# EAGLE design ASM2022 (EAGLE 6.3)
DATABASE: ./../../../../../Components/TinyCircuits_Part_Database.txt
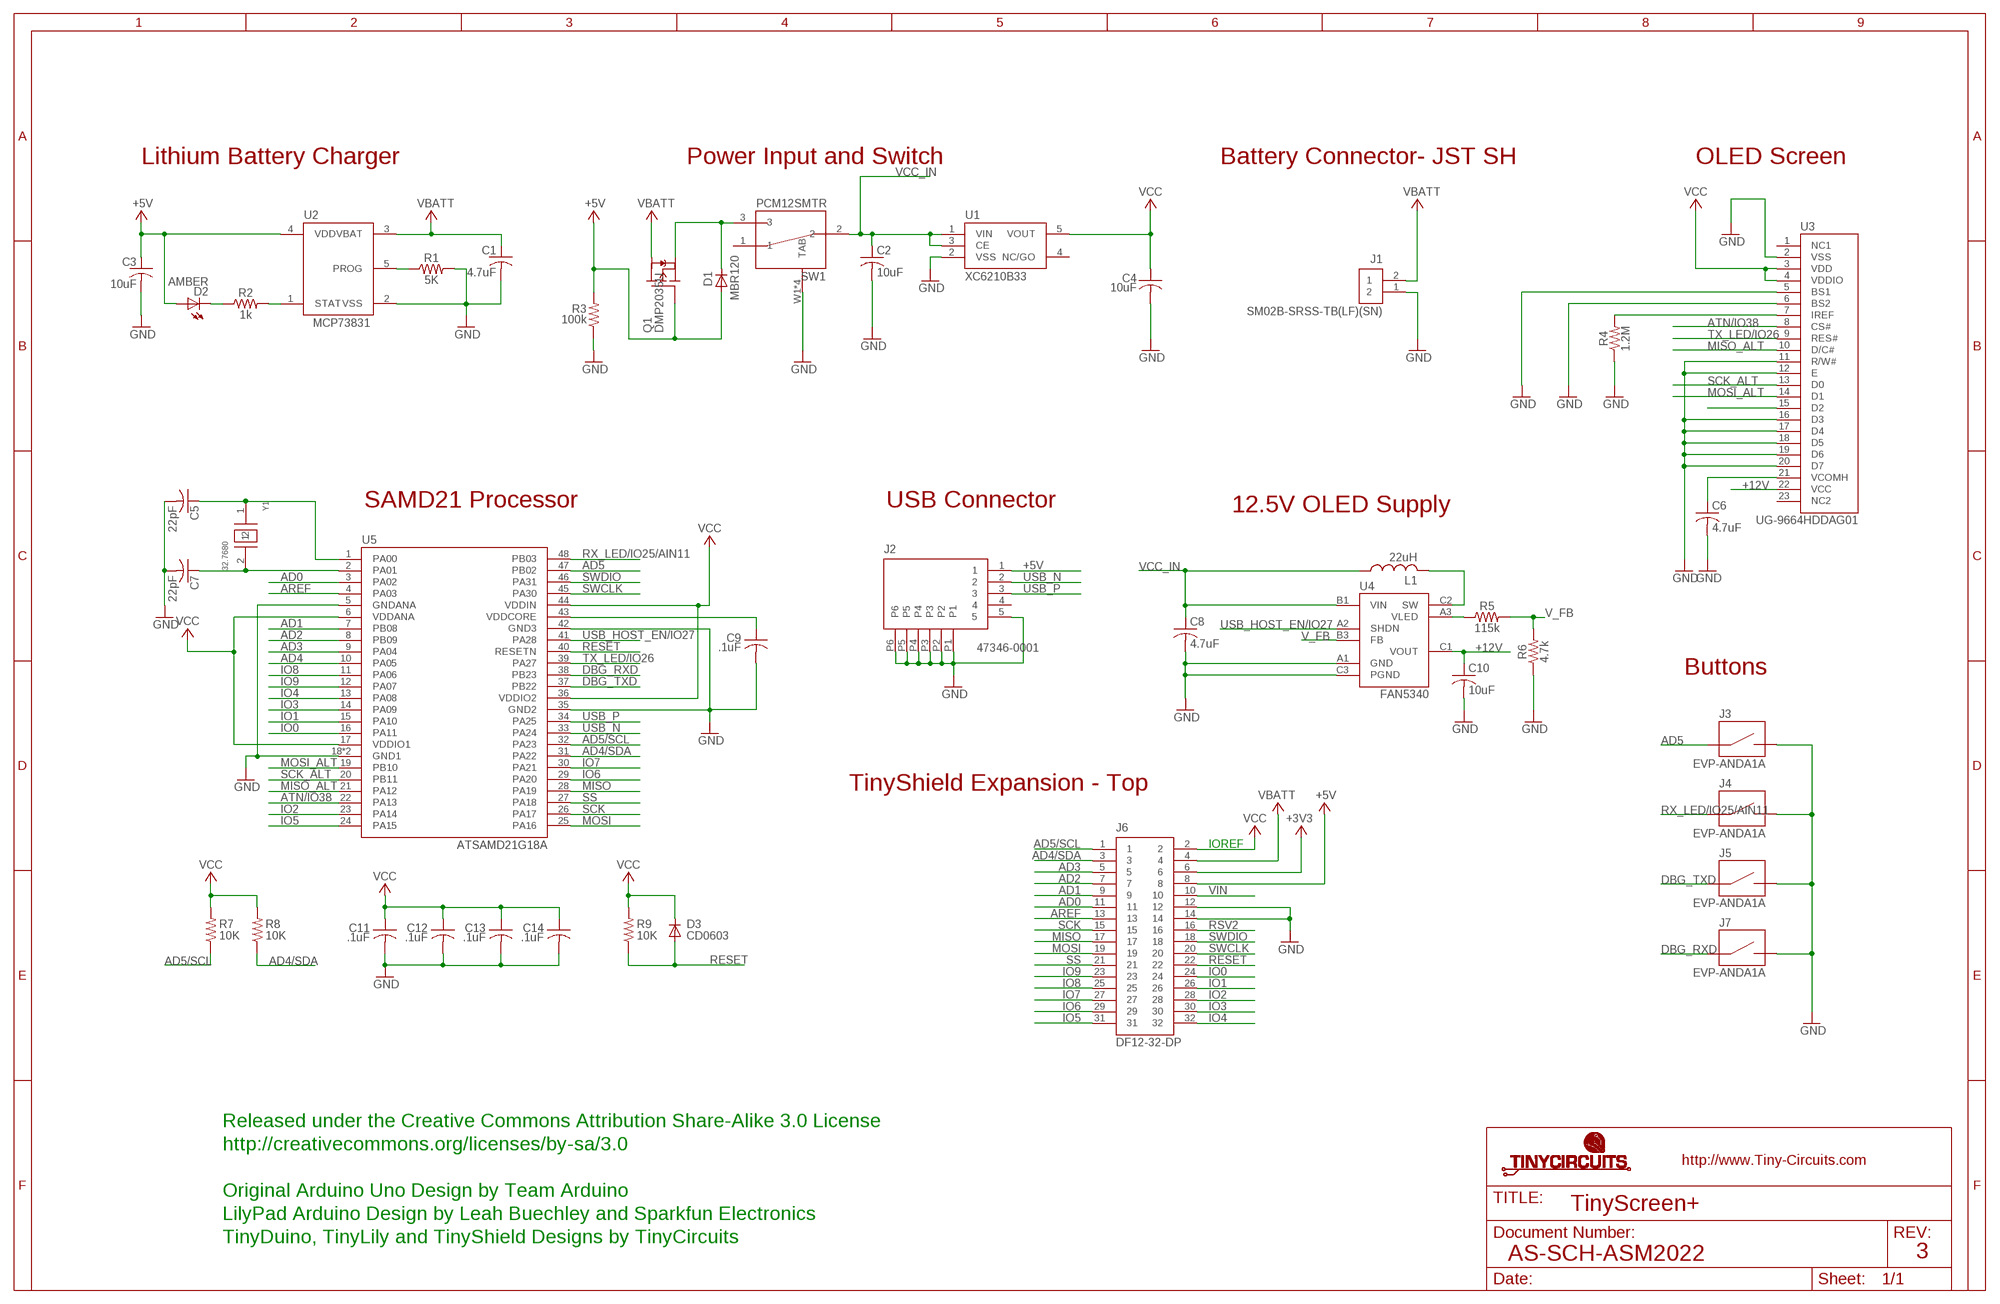
[diagram p0: schematic, sheet 1]

## Parts
C1  4.7uF  AS-ITM-00088  [C0603]
C2  10uF  AS-ITM-00045  [C0805]
C3  10uF  AS-ITM-00002  [C0603]
C4  10uF  AS-ITM-00002  [C0603]
C5  22pF  AS-ITM-00211  [C0402]
C6  4.7uF  AS-ITM-00232  [1206_CAP_TANT]
C7  22pF  AS-ITM-00211  [C0402]
C8  4.7uF  AS-ITM-00242  [C0402]
C9  .1uF  AS-ITM-00008  [C0402]
C10  10uF  AS-ITM-00045  [C0805]
C11  .1uF  AS-ITM-00008  [C0402]
C12  .1uF  AS-ITM-00008  [C0402]
C13  .1uF  AS-ITM-00008  [C0402]
C14  .1uF  AS-ITM-00008  [C0402]
D1  MBR120  AS-ITM-00111  [SOD-123FL]
D2  AMBER  AS-ITM-00026  [LNJ_LED]
D3  CD0603  AS-ITM-00009  [0603]
J1  SM02B-SRSS-TB(LF)(SN)  AS-ITM-00231  [JST_SH_2X1]
J2  47346-0001  AS-ITM-00021  [MICRO_USB]
J3  EVP-ANDA1A  AS-ITM-00236  [PTS840GKP]
J4  EVP-ANDA1A  AS-ITM-00236  [PTS840GKP]
J5  EVP-ANDA1A  AS-ITM-00236  [PTS840GKP]
J6  DF12-32-DP  AS-ITM-00015  [DF12-32-DP]
J7  EVP-ANDA1A  AS-ITM-00236  [PTS840GKP]
L1  22uH  AS-ITM-00281  [R0805]
Q1  DMP2035U  AS-ITM-00024  [SOT23]
R1  5K  AS-ITM-00289  [0402]
R2  1k  AS-ITM-00003  [0402]
R3  100k  AS-ITM-00004  [0402]
R4  1.2M  AS-ITM-00280  [0402]
R5  115k  AS-ITM-00179  [0402]
R6  4.7k  AS-ITM-00167  [0402]
R7  10K  AS-ITM-00032  [0402]
R8  10K  AS-ITM-00032  [0402]
R9  10K  AS-ITM-00032  [0402]
SW1  PCM12SMTR  AS-ITM-00220  [PCM12SMTR]
U1  XC6210B33  AS-ITM-00046  [SOT-25]
U2  MCP73831  AS-ITM-00136  [SOT-23]
U3  UG-9664HDDAG01  AS-ITM-00158  [OLED_DISPLAY]
U4  FAN5340  AS-ITM-00277  [WLCSP8_1_57X1_57]
U5  ATSAMD21G18A  AS-ITM-00273  [QFN48]
Y1  32.7680  AS-ITM-00279  [ABS06]

## Nets
+3V3: J6.6
+5V: C3.1 D1.A D2.A J2.1 J6.8 Q1.B(G) R3.2 U2.4(VDD)
+12V: C10.1 U3.22(VCC) U4.C1(VOUT)
AD0: J6.11 U5.3(PA02)
AD1: J6.9 U5.7(PB08)
AD2: J6.7 U5.8(PB09)
AD3: J6.5 U5.9(PA04)
AD4: U5.10(PA05)
AD4/SDA: J6.3 R8.1 U5.31(PA22)
AD5: J3.1 J3.2 U5.47(PB02)
AD5/SCL: J6.1 R7.1 U5.32(PA23)
AREF: J6.13 U5.4(PA03)
ATN/IO38: U3.8(CS#) U5.22(PA13)
DBG_RXD: J7.1 J7.2 U5.38(PB23)
DBG_TXD: J5.1 J5.2 U5.37(PB22)
GND: C1.2 C2.2 C3.2 C4.2 C5.2 C6.2 C7.2 C8.2 C9.2 C10.2 C11.2 C12.2 C13.2 C14.2 J1.1 J2.5 J2.P1 J2.P2 J2.P3 J2.P4 J2.P5 J2.P6 J3.3 J3.4 J4.3 J4.4 J5.3 J5.4 J6.12 J6.14 J7.3 J7.4 R1.2 R3.1 R4.1 R6.1 SW1.W1(TAB) SW1.W2(TAB) SW1.W3(TAB) SW1.W4(TAB) U1.2(VSS) U2.2(VSS) U3.2(VSS) U3.5(BS1) U3.6(BS2) U3.11(R/W#) U3.12(E) U3.16(D3) U3.17(D4) U3.18(D5) U3.19(D6) U3.20(D7) U4.A1(GND) U4.C3(PGND) U5.5(GNDANA) U5.18(GND1) U5.35(GND2) U5.42(GND3) U5.EXP(GND1)
IO0: J6.24 U5.16(PA11)
IO1: J6.26 U5.15(PA10)
IO2: J6.28 U5.23(PA14)
IO3: J6.30 U5.14(PA09)
IO4: J6.32 U5.13(PA08)
IO5: J6.31 U5.24(PA15)
IO6: J6.29 U5.29(PA20)
IO7: J6.27 U5.30(PA21)
IO8: J6.25 U5.11(PA06)
IO9: J6.23 U5.12(PA07)
MISO: J6.17 U5.28(PA19)
MISO_ALT: U3.10(D/C#) U5.21(PA12)
MOSI: J6.19 U5.25(PA16)
MOSI_ALT: U3.14(D1) U5.19(PB10)
N$1: C5.1 U5.1(PA00) Y1.1
N$2: D1.C Q1.E(S) SW1.3
N$3: C7.1 U5.2(PA01) Y1.2
N$5: D2.C R2.1
N$6: R1.1 U2.5(PROG)
N$7: R2.2 U2.1(STAT)
N$8: C9.1 U5.43(VDDCORE)
N$9: L1.2 U4.C2(SW)
N$11: R4.2 U3.7(IREF)
N$12: C6.1 U3.21(VCOMH)
N$13: R5.1 U4.A3(VLED)
N$15: U3.15(D2)
RESET: D3.A J6.22 R9.1 U5.40(RESETN)
RSV2: J6.16
RX_LED/IO25/AIN11: J4.1 J4.2 U5.48(PB03)
SCK: J6.15 U5.26(PA17)
SCK_ALT: U3.13(D0) U5.20(PB11)
SS: J6.21 U5.27(PA18)
SWCLK: J6.20 U5.45(PA30)
SWDIO: J6.18 U5.46(PA31)
TX_LED/IO26: U3.9(RES#) U5.39(PA27)
USB_HOST_EN/IO27: U4.A2(SHDN) U5.41(PA28)
USB_N: J2.2 U5.33(PA24)
USB_P: J2.3 U5.34(PA25)
V_FB: R5.2 R6.2 U4.B3(FB)
VBATT: C1.1 J1.2 J6.4 Q1.C(D) U2.3(VBAT)
VCC: C4.1 C11.1 C12.1 C13.1 C14.1 D3.C J6.2 R7.2 R8.2 R9.2 U1.5(VOUT) U3.3(VDD) U3.4(VDDIO) U5.6(VDDANA) U5.17(VDDIO1) U5.36(VDDIO2) U5.44(VDDIN)
VCC_IN: C2.1 C8.1 L1.1 SW1.2 U1.1(VIN) U1.3(CE) U4.B1(VIN)
VIN: J6.10
Unconnected: J2.4 SW1.1 U1.4(NC/GO) U3.1(NC1) U3.23(NC2)

## Notes on the sheet
- Lithium Battery Charger | Power Input and Switch | Battery Connector- JST SH | OLED Screen
- SAMD21 Processor | USB Connector | 12.5V OLED Supply
- Buttons
- TinyShield Expansion - Top
- IOREF
- Released under the Creative Commons Attribution Share-Alike 3.0 License
- http://creativecommons.org/licenses/by-sa/3.0
- Original Arduino Uno Design by Team Arduino
- TinyScreen+
- LilyPad Arduino Design by Leah Buechley and Sparkfun Electronics
- TinyDuino, TinyLily and TinyShield Designs by TinyCircuits
- AS-SCH-ASM2022 | 3

## Library data of the parts
C1 = tinycircuits:AS-ITM-00088: CAP CER 4.7UF 6.3V 20% X5R 0603; PARTNO: AS-ITM-00088
C2 C10 = tinycircuits:AS-ITM-00045: CAP CER 16UF 16V 20% X5R 0805; PARTNO: AS-ITM-00045
C3 C4 = tinycircuits:AS-ITM-00002: CAP CER 10UF 10V 20% X5R 0603; PARTNO: AS-ITM-00002
C5 C7 = tinycircuits:AS-ITM-00211: CAP CER 22PF 50V 2% NP0 0402; PARTNO: AS-ITM-00211
C6 = tinycircuits:AS-ITM-00232: CAP TANT 4.7UF 20V 20% 1206; PARTNO: AS-ITM-00232; VALUE: F931D475MAA
C8 = tinycircuits:AS-ITM-00242: CAP CER 4.7UF 6.3V 20% X5R 0402; PARTNO: AS-ITM-00242
C9 C11-C14 = tinycircuits:AS-ITM-00008: CAP CER 0.1UF 16V 10% X5R 0402; PARTNO: AS-ITM-00008; VALUE: 0.1uF
D1 = tinycircuits:AS-ITM-00111: DIODE SCHOTTKY 20V 1A SOD123L; PARTNO: AS-ITM-00111; VALUE: MBR120VLSFT1G
D2 = tinycircuits:AS-ITM-00026: LED AMBER SIDE VIEW SMD; PARTNO: AS-ITM-00026
D3 = tinycircuits:AS-ITM-00009: Diodes (General Purpose, Power, Switching) IO=150mA VR=75V HIGH SPEED; PARTNO: AS-ITM-00009
J1 = tinycircuits:AS-ITM-00231: CONN HEADER SH 2POS SIDE 1MM; PARTNO: AS-ITM-00231
J2 = tinycircuits:AS-ITM-00021: CONN RCPT 5POS MICRO USB R/A; PARTNO: AS-ITM-00021
J3-J5 J7 = tinycircuits:AS-ITM-00236: SWITCH TACTILE SPST-NO 0.05A 12V; PARTNO: AS-ITM-00236; VALUE: PTS840 GKP
J6 = tinycircuits:AS-ITM-00015: CONN HEADER 32POS 3MM SMD 0.5MM; PARTNO: AS-ITM-00015
L1 = tinycircuits:AS-ITM-00281: FIXED IND 22UH 300MA 670 MOHM; PARTNO: AS-ITM-00281
Q1 = tinycircuits:AS-ITM-00024: P-Channel MOSFET SOT-23; PARTNO: AS-ITM-00024
R1 = tinycircuits:AS-ITM-00289: RES SMD 5.0K OHM 1% 1/16W 0402; PARTNO: AS-ITM-00289
R2 = tinycircuits:AS-ITM-00003: RES 1.00K OHM 1/16W 1% 0402; PARTNO: AS-ITM-00003; VALUE: 1.00K
R3 = tinycircuits:AS-ITM-00004: RES 100K OHM 1/16W 1% 0402; PARTNO: AS-ITM-00004; VALUE: 100K
R4 = tinycircuits:AS-ITM-00280: RES SMD 1.2M OHM 1% 1/16W 0402; PARTNO: AS-ITM-00280
R5 = tinycircuits:AS-ITM-00179: RES 115K OHM 1/16W 1% SMD 0402; PARTNO: AS-ITM-00179; VALUE: 115K
R6 = tinycircuits:AS-ITM-00167: RES 4.7K OHM 1/16W 5% 0402 SMD; PARTNO: AS-ITM-00167; VALUE: 4.7K
R7-R9 = tinycircuits:AS-ITM-00032: RES 10.0K OHM 1/16W 1% 0402 SMD; PARTNO: AS-ITM-00032; VALUE: 10.0K
SW1 = tinycircuits:AS-ITM-00220: SW SLIDE SP2T 6VDC 0.3A SMT; PARTNO: AS-ITM-00220
U1 = tinycircuits:AS-ITM-00046: IC REG LDO 3.3V .7A SOT-25; PARTNO: AS-ITM-00046
U2 = tinycircuits:AS-ITM-00136: IC CONTROLLER LI-ION 4.2V SOT23-5; PARTNO: AS-ITM-00136
U3 = tinycircuits:AS-ITM-00158: 0.96" OLED Display; PARTNO: AS-ITM-00158
U4 = tinycircuits:AS-ITM-00277: IC LED BOOST DC DC BACKLIGHT 8-WLCSP; PARTNO: AS-ITM-00277
U5 = tinycircuits:AS-ITM-00273: IC MCU 32BIT 256KB FLASH 48QFN; PARTNO: AS-ITM-00273
Y1 = tinycircuits:AS-ITM-00279: Crystal 32.7680kHz 20ppm 12.5pF; PARTNO: AS-ITM-00279

## Board
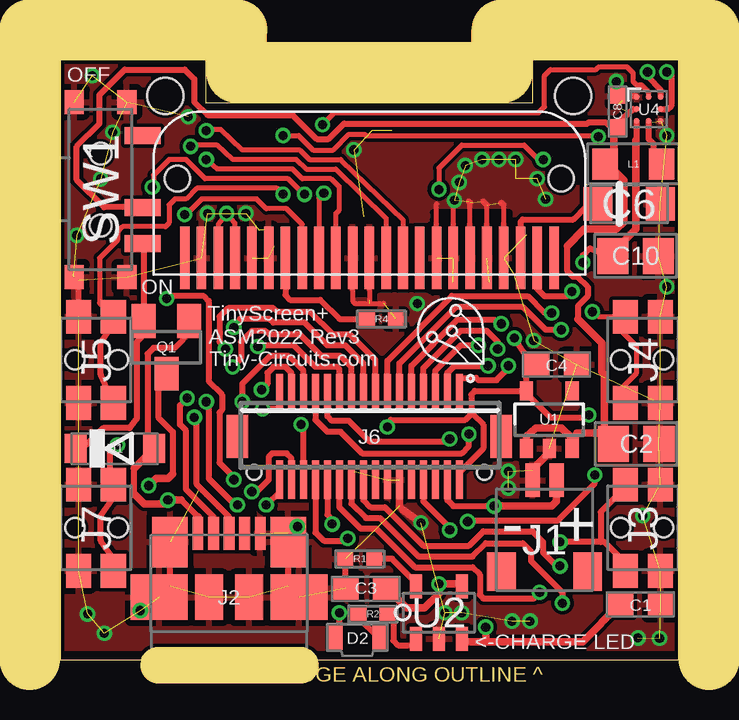
[diagram p1: board, top side]
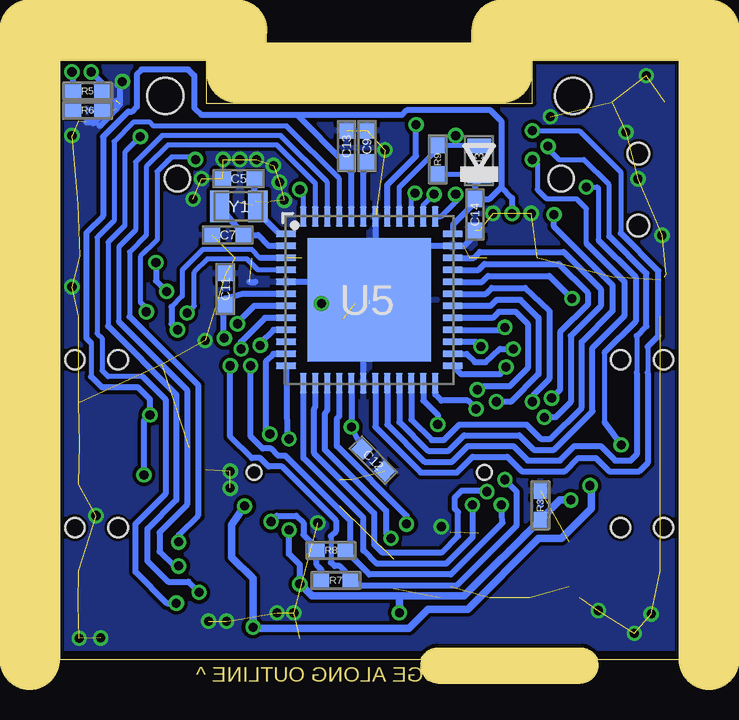
[diagram p2: board, bottom side, seen from below]

Size 25.8 x 25 mm. Coordinates in mm from the lower left corner, seen from the top.
Outline: 3.38,0 0,0 0,25 6.1,25 6.1,23.2 19.7,23.2 19.7,25 25.8,25 25.8,0 10.75,0
Outline: 3.38,0 10.75,0
Outline: 10.75,0 arc60 10.1,0.5 4.03,0.5 arc60 3.38,0
Copper layers (1*16): Top 0.035mm / dielectric 1.5mm / Bottom 0.035mm
Design rules "default *": minimum track width 8mil, minimum drill 15mil, track to track 6mil, track to pad 6mil, pad to pad 6mil, via to via 6mil, smd to smd 6mil, copper to edge 6mil, drill to drill 8mil, minimum pad ring 8mil, minimum via ring 5mil, stop-mask expansion 4mil, vias tented up to drill 25mil, thermal gap 10mil
Holes 1.5 mm at 4.4,23.5 21.4,23.5
tRestrict: 18 lines
bRestrict: 2 lines
Milling: 8 lines

### Footprints (pad centres in the part's own frame; a part is rotated, then mirrored left to right if it is on the bottom)
C0603 = smd 1.1 x 1: 1 -0.85,0; 2 0.85,0
C0805 = smd 1.3 x 1.5: 1 -0.95,0; 2 0.95,0
C0402 = smd 0.65 x 0.6: 1 -0.65,0; 2 0.65,0
1206_CAP_TANT = smd 1.2 x 1.4: 1 -1.3,0; 2 1.3,0
SOD-123FL = smd 0.914 x 1.219: A 1.638,0; C -1.638,0
LNJ_LED = smd 1 x 0.55: A 0,0.9; C 0,-0.9
0603 = smd 0.61 x 0.991: A 0.622,0; C -0.622,0
JST_SH_2X1 = smd 0.6 x 1.4: 1 -0.5,2.475; 2 0.5,2.475 | smd 1.2 x 1.6: PAD1 -1.8,-1.325; PAD2 1.8,-1.325
MICRO_USB = smd 1.38 x 0.45: 1 2.66,1.3; 2 2.66,0.65; 3 2.66,0; 4 2.66,-0.65; 5 2.66,-1.3 | smd 2.1 x 1.475: P1 2.3,-2.462; P2 2.3,2.462 | smd 1.9 x 2.375: P3 0,2.913; P4 0,-2.913 | smd 1.9 x 1.175: P5 0,0.838; P6 0,-0.838
PTS840GKP = smd 1.4 x 1.05: 1 -1.8,0.725; 2 1.8,0.725; 3 -1.8,-0.725; 4 1.8,-0.725 | hole 0.8: 0,0.925; 0,-0.875
DF12-32-DP = smd 0.3 x 1.6: 1 -3.75,-1.8; 2 -3.75,1.8; 3 -3.25,-1.8; 4 -3.25,1.8; 5 -2.75,-1.8; 6 -2.75,1.8; 7 -2.25,-1.8; 8 -2.25,1.8; 9 -1.75,-1.8; 10 -1.75,1.8; 11 -1.25,-1.8; 12 -1.25,1.8; 13 -0.75,-1.8; 14 -0.75,1.8; 15 -0.25,-1.8; 16 -0.25,1.8; 17 0.25,-1.8; 18 0.25,1.8; 19 0.75,-1.8; 20 0.75,1.8; 21 1.25,-1.8; 22 1.25,1.8; 23 1.75,-1.8; 24 1.75,1.8; 25 2.25,-1.8; 26 2.25,1.8; 27 2.75,-1.8; 28 2.75,1.8; 29 3.25,-1.8; 30 3.25,1.8; 31 3.75,-1.8; 32 3.75,1.8 | smd 0.9 x 1.8: F1 -5.5,0; F2 5.5,0 | hole 0.6: -4.8,1.5; 4.8,1.5
R0805 = smd 1.05 x 1.3: 1 -1.175,0; 2 1.175,0
SOT23 = smd 1 x 1.4: B -0.95,-1.1; C 0,1.1; E 0.95,-1.1
0402 = smd 0.65 x 0.55: 1 -0.6,0; 2 0.6,0
PCM12SMTR = smd 0.7 x 1.5: 1 -2.25,1.75; 2 0.75,1.75; 3 2.25,1.75 | smd 1 x 0.8: W1 -3.65,1.1; W2 -3.65,-1.1; W3 3.65,-1.1; W4 3.65,1.1 | hole 0.9: 1.5,0; -1.5,0
SOT-25 = smd 0.55 x 0.8: 1 -0.95,-1.2; 2 0,-1.2; 3 0.95,-1.2; 4 0.95,1.2; 5 -0.95,1.2
SOT-23 = smd 0.5 x 1: 1 -0.95,-1.1; 2 0,-1.1; 3 0.95,-1.1; 4 0.95,1.1; 5 -0.95,1.1
OLED_DISPLAY = smd 0.4 x 2.6: 1 -7.7,0.2; 2 -7,0.2; 3 -6.3,0.2; 4 -5.6,0.2; 5 -4.9,0.2; 6 -4.2,0.2; 7 -3.5,0.2; 8 -2.8,0.2; 9 -2.1,0.2; 10 -1.4,0.2; 11 -0.7,0.2; 12 0,0.2; 13 0.7,0.2; 14 1.4,0.2; 15 2.1,0.2; 16 2.8,0.2; 17 3.5,0.2; 18 4.2,0.2; 19 4.9,0.2; 20 5.6,0.2; 21 6.3,0.2; 22 7,0.2; 23 7.7,0.2 | hole 1.05: 8,3.5; -8,3.5
WLCSP8_1_57X1_57 = smd 0.25 x 0.25: A1 -0.5,0.5; A2 0,0.5; A3 0.5,0.5; B1 -0.5,0; B3 0.5,0; C1 -0.5,-0.5; C2 0,-0.5; C3 0.5,-0.5
QFN48 = smd 0.85 x 0.28: 1 -3.475,2.75; 2 -3.475,2.25; 3 -3.475,1.75; 4 -3.475,1.25; 5 -3.475,0.75; 6 -3.475,0.25; 7 -3.475,-0.25; 8 -3.475,-0.75; 9 -3.475,-1.25; 10 -3.475,-1.75; 11 -3.475,-2.25; 12 -3.475,-2.75; 25 3.475,-2.75; 26 3.475,-2.25; 27 3.475,-1.75; 28 3.475,-1.25; 29 3.475,-0.75; 30 3.475,-0.25; 31 3.475,0.25; 32 3.475,0.75; 33 3.475,1.25; 34 3.475,1.75; 35 3.475,2.25; 36 3.475,2.75 | smd 0.28 x 0.85: 13 -2.75,-3.475; 14 -2.25,-3.475; 15 -1.75,-3.475; 16 -1.25,-3.475; 17 -0.75,-3.475; 18 -0.25,-3.475; 19 0.25,-3.475; 20 0.75,-3.475; 21 1.25,-3.475; 22 1.75,-3.475; 23 2.25,-3.475; 24 2.75,-3.475; 37 2.75,3.475; 38 2.25,3.475; 39 1.75,3.475; 40 1.25,3.475; 41 0.75,3.475; 42 0.25,3.475; 43 -0.25,3.475; 44 -0.75,3.475; 45 -1.25,3.475; 46 -1.75,3.475; 47 -2.25,3.475; 48 -2.75,3.475 | smd 5.15 x 5.15: EXP 0,0
ABS06 = smd 0.8 x 1.3: 1 -0.8,0; 2 0.8,0

### Placement (x,y rotation side)
C1  24.2,2.3 0 top
C2  24.03,8.99 0 top
C3  12.75,2.96 180 top
C4  20.7,12.3 0 top
C5  18.35,20.05 180 bottom
C6  23.73,19 0 top
C7  18.8,17.7 180 bottom
C8  23.25,22.85 90 top
C9  13,21.4 90 bottom
C10  24,16.83 0 top
C11  18.9,15.45 90 bottom
C12  12.73,8.31 315 bottom
C13  13.85,21.4 90 bottom
C14  8.5,18.55 270 bottom
D1  2.29,8.8 0 top
D2  12.4,0.9 90 top
D3  8.32,20.8 90 bottom
J1  20.2,5 0 top
J2  7.05,2.6 90 top
J3  24.3,5.5 90 top
J4  24.3,12.5 90 top
J5  1.5,12.5 270 top
J6  12.9,9.3 180 top
J7  1.5,5.5 270 top
L1  23.91,20.66 0 top
Q1  4.44,13.02 180 top
R1  12.5,4.2 180 top
R2  13.05,1.9 0 top
R3  5.77,6.43 270 bottom
R4  13.4,14.2 180 top
R5  24.65,23.7 180 bottom
R6  24.65,22.9 180 bottom
R7  14.3,3.3 180 bottom
R8  14.5,4.55 180 bottom
R9  10.05,20.85 270 bottom
SW1  1.69,19.6 270 top
U1  20.4,10 0 top
U2  15.8,1.96 0 top
U3  12.9,16.55 0 top
U4  24.55,22.95 0 top
U5  12.9,15 0 bottom
U$1  [DOCFIELD-TINYCIRCUITS-PCB]  36.9,-5 0 top  (outside the outline)
Y1  18.35,18.9 180 bottom

### Tracks (layer width: path | path; a pad name or v marks a point on that pad's centre or on a via)
+5V  (via drill 0.38)
  Top 0.254: J6.8 15.15,6.6 16.25,5.5 v16.25,5.4 | Q1.B 5.49,13.69 4.8,13 3.9,13 3.65,12.75 3.65,9.03 D1.A | 3.1,6.9 3.1,7.97 | C3.1 13.65,2.95 | 5.75,5.95 5.05,6.65 | D2.A 11.65,1.05 v11.65,1.95 | U2.4 16.71,3.15
  Top 0.305: 5.75,5.95 J2.1 | 3.1,6.9 3.5,6.5 4.35,6.5 v4.5,6.65 5.05,6.65 | 3.1,7.97 D1.A | 13.65,2.95 14.45,2.15 15.2,2.15 15.8,2.75 v15.8,3.15 16.71,3.15
  Bottom 0.254: R3.2 | v15.8,3.15 15.8,3.95 16.25,4.4 v16.25,5.4
  Bottom 0.305: 11.65,2.65 8.95,2.65 R3.2 | v11.65,1.95 11.65,2.65 | 11.65,2.65 15.3,2.65 v15.8,3.15 | R3.2 4.95,6.65 v4.5,6.65
+12V  (via drill 0.38)
  Top 0.254: U3.22 19.9,15.45 20.2,15.15 21.15,15.15 v21.35,15.35 | v21.8,16.55 21.8,16.85 22.1,17.15 23.15,16.7 23,16.85 23.05,16.65 23.08,16.88 C10.1 23.4,17.18 23.4,17.35 | U4.C1 24.05,21.7 24,21.65
  Top 0.305: 24,21.65 24,17.95 23.4,17.35
  Bottom 0.254: v21.8,16.55 21.8,15.8 v21.35,15.35
AD0  (via drill 0.38)
  Top 0.254: J6.11 14.15,12.35 16.5,14.7 19.3,14.7 20.25,13.75 v20.9,13.75
  Bottom 0.203: 17.45,16.75 17.8,17.1 19.85,17.1 20.7,16.25 20.7,15.15 21.15,14.7
  Bottom 0.254: U5.3 17.45,16.75 | 21.15,14.7 21.15,14 v20.9,13.75
AD1  (via drill 0.38)
  Top 0.254: J6.9 14.65,12.25 16.55,14.15 18.15,14.15 18.3,14 v18.4,14
  Bottom 0.254: U5.7 17.7,14.75 18.4,14.05 v18.4,14
AD2  (via drill 0.38)
  Top 0.254: J6.7 15.15,12.15 16.7,13.7 17.8,13.7 18.25,13.25 v18.25,12.95
  Bottom 0.254: U5.8 17.25,14.25 18.25,13.25 v18.25,12.95
AD3  (via drill 0.38)
  Top 0.254: J6.5 15.65,12.05 16.7,13.1 v17.45,13.1
  Bottom 0.254: U5.9 16.9,13.75 17.45,13.2 v17.45,13.1
AD4/SDA  (via drill 0.38)
  Top 0.254: J6.3 16.15,11.95 16.45,12.25 v17.85,12.25 | v6.1,10.75 6.2,10.65 6.2,7.55 7.2,6.55 7.35,6.55 v7.4,6.45
  Bottom 0.254: U5.31 8.05,15.25 7.8,15.5 6.4,15.5 5.4,14.55 5.4,11.7 6.05,11.05 v6.1,10.75 | 17.85,11.95 v17.85,12.25 17.85,9.3 17.35,8.8 17,8.8 16.7,8.5 16.4,8.5 13.7,5.8 13.7,4.75 R8.1 12.9,3.55 9.5,3.55 7.35,5.7 v7.4,6.45
AD5  (via drill 0.38)
  Top 0.254: J3.1 23.58,4.03 22.7,4.9 22.55,4.9 | 22.55,4.9 v20.85,4.9 | J3.2 23.58,7.18 22.55,6.15 22.55,4.9
  Bottom 0.203: U5.47 15.15,19.85 16.75,21.45 21.3,21.45 22.2,20.55 22.2,17.7 22.9,17 22.9,14.3
  Bottom 0.254: 22.9,14.3 20.05,11.45 20.05,6 20.85,5.2 v20.85,4.9
AD5/SCL  (via drill 0.38)
  Top 0.254: J6.1 16.65,11.75 17.35,11.75 17.45,11.65 18.2,11.65 18.7,12.15 v18.7,12.25 | v4.45,15.05 4.55,15.15 6,15.15 6.2,14.95 6.2,11.6 6.75,11.05 6.75,10.4 6.65,10.3 6.65,8.2 7.25,7.6 v7.25,7.5
  Bottom 0.203: 14.5,5.15 14.5,4.05
  Bottom 0.254: U5.32 8.2,15.75 7.95,16 5.4,16 v4.45,15.05 | v18.7,12.25 18.7,9.3 17.8,8.4 17.45,8.4 17.1,8.05 16.55,8.05 14.3,5.8 14.3,5.35 14.5,5.15 | v7.25,7.5 6.75,7 6.75,5.6 9.25,3.1 13.25,3.1 R7.1 13.7,3.45 14.15,3.9 14.35,3.9 14.5,4.05
AREF  (via drill 0.38)
  Top 0.254: J6.13 13.65,12.45 16.33,15.17 16.35,15.15 19.5,15.15 20.2,14.45 v20.5,14.45
  Bottom 0.203: U5.4 17.55,16.25 18,16.7 19.65,16.7 20.2,16.15 20.2,14.75 v20.5,14.45
ATN/IO38  (via drill 0.38)
  Top 0.203: U3.8 10.1,18.15 9.45,18.8 8.6,18.8 8.2,19.2 5.9,19.2 5.25,18.55
  Top 0.254: v5.2,18.55 5.25,18.55
  Bottom 0.254: U5.22 11.15,10 10.3,9.15 9.8,9.15 9.15,9.8 6.35,9.8 5.75,9.2 5.35,9.2 4.05,10.5 4.05,13.25 2.75,14.55 2.75,15.6 5.2,18.05 v5.2,18.55
DBG_RXD  (via drill 0.38)
  Top 0.203: v10.2,19.4 10.15,19.4 9.5,20.05 6.05,20.05 5.25,20.85 4.55,20.85 3.9,20.2 3.9,19.75 v3.85,19.7
  Top 0.254: J7.2 2.22,4.22 1.7,4.95 1.7,6 2.2,6.7 2.2,7.28 J7.1 2.1,7.43 2.1,8.65 v2.4,8.95
  Bottom 0.203: U5.38 10.65,18.95 v10.2,19.4 | 3.35,17.5 3.35,19.65 3.4,19.7 v3.85,19.7 | 3.1,12.8 3.1,9.9
  Bottom 0.254: 3.35,17.5 1.8,15.95 1.8,14.1 3.1,12.8 | 3.1,9.9 v2.4,8.95
DBG_TXD  (via drill 0.38)
  Top 0.203: v9.3,19.4 9.05,19.65 5.7,19.65 5.25,19.2 4.8,19.2 4.55,18.95 4.55,18.2 4.4,18.05 2.6,18.05 2.4,17.85 2.4,17.5 1.65,16.75 1.65,14.88 J5.1
  Top 0.254: J5.2 1.7,11.88 1.7,13.2 2.22,13.98 J5.1
  Bottom 0.203: U5.37 9.92,18.48 9.15,19.25 v9.3,19.4
GND  (via drill 0.38)  (80 unrouted)
  Top 0.203: U3.16 15.7,19 | U3.17 16.4,19.1 | U3.18 17.1,19.05 | U3.19 17.8,18.95 | U3.20 18.5,18.95 | U3.12 12.9,14.85 | 12.9,14.85 13.5,14.85 | U3.11 12.2,14.95 12.3,14.85 12.9,14.85
  Top 0.254: 14.15,6.4 14.3,6.25 14.4,6.2 | 14.15,7.05 J6.12 | 14.45,6.1 v15.05,5.7 | J5.3 0.78,15.82 0.55,16.05 | C3.2 R1.2 | J2.P3 4.59,3.05 J2.P2 | J2.P4 9.51,3.05 J2.P1 9.51,5.3 v9.9,5.54 | v23.2,24.1 23.1,24.05 C8.2 24,23.5 U4.A1 | 16.4,19.1 v16.45,19.15 | 17.1,19.05 17.05,19.1 | 17.8,18.95 17.65,19.1 | 18.5,18.95 18.4,19.05 | 20.4,8.65 U1.2
  Top 0.305: 14.15,7.05 14.15,6.4 | v15.05,5.7 14.3,6.25 | J1.1 19.7,7.9 20.4,8.65
  Bottom 0.254: U5.42 12.65,16.3 | 12.65,16.3 U5.EXP | U5.EXP 14.5,15 | 14.5,15 15.25,15.75 U5.5 | U5.18 13.15,14.75 U5.EXP | 8.3,17.9 8.95,17.25 U5.35 10.8,17.25 12.65,16.3 | 17.9,15.75 17.65,15.75 | 14.5,15 14.66,14.84 v14.9,14.84 | 23.4,23.95 v23.2,24.1 23.3,23.95 23.3,23.15 23.55,22.9 R6.1 | 24.15,22.25 23.45,22.95 | 24.35,22.4 23.45,23.3 | 24.7,22.4 24.35,22.4 | 24.35,22.4 24.3,22.4 | 24.4,22.35 24.35,22.4
  other vias: 19,20.85 1.15,1.9 17.6,20.85 1.85,1.09 1.7,20.04 12.25,21.25 24.1,0.9 16.65,19.9 16.9,20.6 18.3,20.85 7.75,18.6 19.9,20.05 1.35,24.34 0.7,17.69 6.15,18.6 20.25,19.2 19.75,13.3 16.75,1.95 16.05,1.95 18.7,7.85 18.7,7.15 24.3,6 5.35,22.64 25,0.89 25.3,15.54 25.3,21.85 18.85,1.6 19.6,1.6 3.35,2.04 2.2,21.99
  pour Top: 25.8,25 19.9,25 19.9,23.2 5.9,23.2 5.9,25 0,25 0,0 25.8,0
  pour Bottom: 25.8,25 19.7,25 19.7,23.2 6.1,23.2 6.1,25 0,25 0,0 25.8,0
IO0  (via drill 0.38)
  Top 0.254: J6.24 11.15,6.05 11.35,5.8 v11.35,5.65
  Bottom 0.254: 11.34,5.91 v11.35,5.65 11.35,6 14.25,8.9 14.25,10.05 14.15,10.15 U5.16
IO1  (via drill 0.38)
  Top 0.254: J6.26 10.65,5.3 11,4.95 11.9,4.95 v12,5.05
  Bottom 0.254: v12,5.05 12.2,5.25 12.2,6.2 14.75,8.75 14.75,10.25 14.65,10.4 U5.15
IO2  (via drill 0.38)
  Top 0.254: J6.28 10.15,9.7 v10.05,9.8
  Bottom 0.254: U5.23 10.65,10.8 10.05,10.2 v10.05,9.8
IO3  (via drill 0.38)
  Top 0.254: J6.30 9.65,8.4 9.45,8.6 8.85,8.6 8.7,8.45 8.7,7.5 8.2,7 v8,7
  Bottom 0.254: v8,7 8.05,7.05 9.05,7.05 9.35,6.75 9.35,6.3 9.2,6.15 9.2,5.15 9.9,4.45 12.35,4.45 12.7,4.8 12.7,6.1 15.2,8.6 15.2,10.45 15.15,10.55 U5.14
IO4  (via drill 0.38)
  Top 0.254: J6.32 9.15,7 v8.6,6.45
  Bottom 0.254: v8.6,6.45 8.6,5.1 9.7,4 12.6,4 13.15,4.55 13.15,5.9 15.65,8.4 U5.13
IO5  (via drill 0.38)
  Top 0.254: J6.31 9.15,10.45 v8.45,10.45
  Bottom 0.254: v8.45,10.45 8.8,10.8 9.9,10.8 10.15,11.05 U5.24
IO6  (via drill 0.38)
  Top 0.254: J6.29 9.65,11.95 9.4,12.2 8.9,12.2 8.65,11.95 8.65,11.5 v8.4,11.25
  Bottom 0.254: v8.4,11.25 8.25,11.4 7.05,11.4 6.3,12.15 6.3,14 6.8,14.5 7.5,14.5 7.75,14.25 U5.29
IO7  (via drill 0.38)
  Top 0.254: J6.27 10.15,12.05 9.55,12.65 8.75,12.65 7.6,11.5 v7.6,10.75 7.6,10.95
  Bottom 0.254: U5.30 7.85,14.75 7.6,15 6.6,15 5.85,14.25 5.85,11.9 7,10.75 v7.6,10.75
IO8  (via drill 0.38)
  Top 0.254: J6.25 10.65,10 11.15,9.5 11.7,9.5 12.6,8.6 16.75,8.6 17.05,8.9 v17.05,9.4
  Bottom 0.254: U5.11 16.9,12.75 17.2,12.45 17.2,9.55 v17.05,9.4
IO9  (via drill 0.38)
  Top 0.254: J6.23 11.15,10.15 11.35,9.95 12.05,9.95 12.9,9.1 16.15,9.1 v16.25,9.2
  Bottom 0.254: U5.12 16.33,9.28 v16.25,9.2
MISO  (via drill 0.38)
  Top 0.254: J6.17 12.65,12.35 11.9,13.1 11.15,13.1 10.2,14.05 8.9,14.05 8.7,14.2 7.5,14.2 v7.25,13.85
  Bottom 0.254: U5.28 7.15,13.75 v7.25,13.85
MISO_ALT  (via drill 0.38)
  Top 0.203: v6.1,20.85 6.55,20.45 9.7,20.45 10.1,20.05 11.3,20.05 11.65,19.7 11.65,18.75 11.5,18.6 U3.10
  Bottom 0.203: 3.85,17.35 3.85,18.8 4.25,19.2 5.5,19.2 5.9,19.6 5.9,20.7 v6.1,20.85
  Bottom 0.254: U5.21 11.65,9.9 10.45,8.7 9.6,8.7 8.95,9.35 6.65,9.35 6.05,8.75 5.2,8.75 3.6,10.35 3.6,13 2.25,14.35 2.25,15.75 3.85,17.35
MOSI  (via drill 0.38)
  Top 0.254: v7.2,12.2 7.55,12.55 7.55,13.25 8,13.7 8.55,13.7 8.75,13.55 10,13.55 10.9,12.65 11.7,12.65 12.15,12.2 J6.19
  Bottom 0.254: U5.25 9.08,11.9 7.45,11.9 v7.2,12.2
MOSI_ALT  (via drill 0.38)
  Top 0.203: U3.14 14.3,18.35 11.72,20.82 11.7,20.85 10.4,20.85 10,21.25 7.6,21.25 6.7,22.1 6.15,22.1 v6.1,22.05
  Bottom 0.203: 2.43,17.77 2.43,20.32 4.15,22.05 v6.1,22.05 | 1.3,13.05 1.3,11.95
  Bottom 0.254: U5.19 12.65,9.7 10.75,7.8 9.25,7.8 8.6,8.45 7.15,8.45 6.55,7.85 4.75,7.85 4.2,8.4 3.45,8.4 2.9,7.85 1.65,7.85 1.3,8.2 1.3,11.95 | 1.3,13.05 0.85,13.5 0.85,16.2 2.43,17.77
N$1
  Bottom 0.254: C5.1 17.7,18.9 | 17.7,18.9 Y1.1 | U5.1 16.65,17.75 17.65,18.75 17.7,18.9
N$2
  Top 0.254: D1.C 0.65,8.95 1.1,8.95 1.8,9.65 2.9,9.65 3.2,10.05 3.2,13.25 3.59,13.64 Q1.E 3.49,17.3 SW1.3
N$3
  Bottom 0.254: U5.2 17.1,17.25 17.55,17.7 C7.1 Y1.2
N$5
  Top 0.254: D2.C 12.45,1.75 R2.1
N$6
  Top 0.254: U2.5 14.95,3.1 13.85,4.2 R1.1
N$7
  Top 0.254: R2.2 13.9,1.6 13.9,0.8 14.1,0.6 14.7,0.6 U2.1
N$8
  Bottom 0.254: U5.43 13.15,20.35 12.9,20.6 C9.1
N$9
  Top 0.254: L1.2 24.75,20.94 24.75,21.5 24.55,21.7 U4.C2
N$11
  Top 0.254: U3.7 9.4,15.2 9.6,15 10.85,15 11.65,14.2 R4.2
N$12
  Top 0.254: U3.21 19.2,18.25 19.3,18.35 21.4,18.35 21.95,18.9 22.88,18.9 C6.1
N$13  (via drill 0.38)
  Top 0.254: U4.A3 25.05,23.75 24.5,24.3 v24.5,24.5
  Bottom 0.254: R5.1 24.05,24.05 v24.5,24.5
RESET  (via drill 0.38)
  Top 0.203: v9.3,21.85 9.95,21.85 10.55,21.25 11.4,21.25 12.05,21.9 12.7,21.9 12.75,21.85 22.35,21.85 v22.45,21.8
  Top 0.254: J6.22 11.65,6.35 12.55,5.45 13.2,5.45 14.8,3.85 17.2,3.85 17.5,3.55 17.5,2.7 17.65,2.55 19.75,2.55 v20,2.8
  Bottom 0.203: U5.40 11.65,19.7 10.05,21.3 R9.1 9.3,21.45 | v22.45,21.8 23.1,21.15 23.1,18.1 23.8,17.4 23.8,13.9 | 9.3,21.45 8,21.45 D3.A | 9.3,21.45 v9.3,21.85
  Bottom 0.254: 23.8,13.9 20.95,11.05 20.95,6.65 22.15,5.45 22.15,4.1 21.3,3.25 20.45,3.25 v20,2.8
RX_LED/IO25/AIN11  (via drill 0.38)
  Top 0.203: v15.8,19.6 15.8,20.5 16.75,21.45 19.35,21.45 19.95,20.85 v20.15,20.85 | v22.2,14.5 22.45,14.3 J4.2 | 23.33,11.23 24.05,11.95 24.05,13.05 23.4,13.7
  Top 0.254: J4.1 23.33,11.23 | 23.4,13.7 23.65,14.23 J4.2
  Bottom 0.203: U5.48 15.65,19.45 v15.8,19.6 | v20.15,20.85 20.25,20.95 21.15,20.95 21.75,20.35 21.75,17.5 22.45,16.8 22.45,14.9 22.2,14.65 v22.2,14.5
SCK  (via drill 0.38)
  Top 0.254: v6.9,12.95 6.65,13.25 6.65,14.3 7,14.65 8.9,14.65 9.1,14.5 10.45,14.5 11.4,13.55 12.1,13.55 13.15,12.5 J6.15
  Bottom 0.254: U5.26 8.85,12.75 8.5,12.4 8.05,12.4 7.45,12.95 v6.9,12.95
SCK_ALT  (via drill 0.38)
  Top 0.203: U3.13 13.6,18.4 11.5,20.45 10.25,20.45 9.85,20.85 7.2,20.85 6.55,21.45 5.55,21.45 5.5,21.4 v5.45,21.4
  Bottom 0.203: 2.9,17.65 2.9,19.8 3.95,20.85 5,20.85 5.45,21.3 v5.45,21.4 | 1.75,13.5 1.75,11.95
  Bottom 0.254: U5.20 12.15,9.8 10.6,8.25 9.45,8.25 8.8,8.9 6.9,8.9 6.3,8.3 4.95,8.3 4.35,8.9 3.25,8.9 2.65,8.3 2,8.3 1.75,8.55 1.75,11.95 | 2.9,17.65 1.35,16.1 1.35,13.9 1.75,13.5
SS  (via drill 0.38)
  Top 0.254: J6.21 11.65,12.1 11.55,12.2 10.65,12.2 9.75,13.1 8.35,13.1 v8.25,13.05
  Bottom 0.254: v8.25,13.05 8.45,13.25 U5.27
SWCLK  (via drill 0.38)
  Top 0.254: J6.20 12.15,6.5 12.75,5.9 13.35,5.9 14.95,4.3 17.2,4.3 17.75,4.85 19.3,4.85 19.65,4.5 19.65,4.1 20.95,2.8 v20.95,2.35
  Bottom 0.203: U5.45 14.15,20.05 16.35,22.25 21.9,22.25 22.05,22.4 22.75,22.4 23.55,21.6 23.55,18.3 24.25,17.6 24.25,13.6 24.05,13.4 24.05,12.05 23.8,11.8 22.35,11.8
  Bottom 0.254: 22.35,11.8 21.4,10.85 21.4,6.9 22.65,5.65 22.65,3.65 21.35,2.35 v20.95,2.35
SWDIO  (via drill 0.38)
  Top 0.254: J6.18 12.65,6.65 12.95,6.35 13.55,6.35 15.15,4.75 17.05,4.75 17.65,5.35 19.7,5.35 20.15,4.9 20.15,4.45 20.7,3.9 v20.85,3.9
  Bottom 0.203: U5.46 14.65,19.9 16.6,21.85 21.55,21.85 22.65,20.75 22.65,17.9 23.35,17.2 23.35,14.1
  Bottom 0.254: 23.35,14.1 20.5,11.25 20.5,6.45 21.65,5.3 21.65,4.5 21.05,3.9 v20.85,3.9
TX_LED/IO26  (via drill 0.38)
  Top 0.203: v11,19.45 10.8,19.25 U3.9
  Bottom 0.203: U5.39 11.15,19.3 v11,19.45
USB_HOST_EN/IO27  (via drill 0.38)
  Top 0.203: v10.95,22.3 11.45,22.8 19.95,22.8 20.2,23.05 20.2,24.35 20.45,24.6 22.35,24.6 22.45,24.7 23.65,24.7 23.9,24.45 23.9,24.1 24.05,23.95 24.25,23.95 24.55,23.65 U4.A2
  Bottom 0.254: U5.41 12.15,19.8 10.95,21 v10.95,22.3
USB_N  (via drill 0.38)
  Top 0.254: J2.2 6.4,5.95 5.25,7.1 5.25,9.55 5,9.8 5,10.6 v5.3,10.9
  Bottom 0.254: U5.33 8.35,16.25 8.1,16.5 5,16.5 3.8,15.3 3.8,14.8 4.95,13.65 4.95,11.25 v5.3,10.9
USB_P  (via drill 0.38)
  Top 0.254: J2.3 7.05,5.95 5.7,7.3 5.7,10 v5.6,10.1
  Bottom 0.254: U5.34 8.55,16.75 8.3,17 4.8,17 3.25,15.45 3.25,14.75 4.5,13.5 4.5,10.75 5.15,10.1 v5.6,10.1
V_FB  (via drill 0.38)
  Top 0.254: U4.B3 25.35,22.95 25.5,23.1 25.5,24.4 v25.3,24.5
  Bottom 0.254: v25.3,24.5 25.25,24.45 R5.2 R6.2
VBATT  (via drill 0.38)
  Top 0.254: J6.4 16.15,6.65 16.4,6.4 v18.1,6.4 | Q1.C 4.1,11.53 4.1,10.1 4.7,9.5 4.7,7.75 | U2.3 16.85,0.75
  Top 0.305: 4.7,7.75 4.5,7.55 4,7.55 v3.7,7.25 | J1.2 20.7,6.6 20.5,6.4 v18.1,6.4 | 16.85,0.75 17.75,0.75 | 17.75,0.75 21.8,0.75 C1.1 | v17.75,1.35 17.75,0.75
  Bottom 0.254: v3.7,7.25 3.7,7.2 3.65,7.25 | 17.65,1.3 v17.75,1.35
  Bottom 0.305: v18.1,6.4 18.64,5.61 18.64,4.26 17.75,3.38 v17.75,1.35 | 3.65,7.25 3.65,6.3 4.9,5.05 5.85,5.05 8.8,2.1 10.45,2.1 11.25,1.3 17.65,1.3
VCC  (via drill 0.38)
  Top 0.203: U3.3 6.6,18.15 v6.95,18.6 7.3,18.2 U3.4
  Top 0.254: v13.65,9.7 13.8,10 16.9,10 17.15,10.25 | 17.15,10.25 17.15,11.05 17.3,11.2 U1.5 | U1.5 19.45,11.95 C4.1 19.35,12.8 v18.95,13.4 | U1.5 19.45,11.1 20.45,10.1 22,10.1 v22.05,10.2 | v17,5.75 17.05,5.8 20.75,5.8 22.3,7.35 v22.3,7.7 | 17.15,10.25 17.2,10.25 17.65,9.8 17.65,8.8 16.65,7.8 J6.2
  Bottom 0.203: 24.5,13.2 24.5,11.8 | R9.2 8.05,20.25 D3.C
  Bottom 0.254: U5.6 18.2,15.25 18.85,15.05 | U5.17 v13.65,9.7 C12.1 | U5.44 13.65,20.3 13.85,20.5 C13.1 13.95,20.75 15.9,22.7 | U5.36 9.4,17.77 9.4,18.15 8.45,19.1 C14.1 | 18.85,15.05 C11.1 19,14.8 19,13.45 v18.95,13.4 | 18.85,15.05 18.95,15.05 | D3.C 8,20.35 | 15.9,22.7 11.55,22.7 11.35,22.9 7.85,22.9 7.4,22.45 7.4,19.7 | 15.9,22.7 19.9,22.7 20.2,23 20.2,24.35 20.45,24.6 22.4,24.6 22.6,24.4 22.6,23.05 22.8,22.85 22.95,22.85 24,21.8 24,18.5 24.7,17.8 24.7,13.4 24.5,13.2 | 24.5,11.8 24.05,11.35 22.55,11.35 22.05,10.85 v22.05,10.2 22.3,9.95 v22.3,7.7 | R7.2 14.9,3.75 15.1,3.95 R8.2 | R8.2 15.1,4.6 | v17,5.75 16.75,6 15.95,6 15.65,5.7 15.65,5.2 15.1,4.65 R8.2 | 7.4,19.7 6.95,19.25 v6.95,18.6 | C14.1 7.9,19.2 7.4,19.7 | 8.05,20.25 8.5,19.8 C14.1
VCC_IN
  Top 0.254: 23.08,9.12 C2.1 22.7,9.37 | 21.6,14.2 21.6,14.75 22,15.15 22,15.55 21.6,15.95 21.4,15.95 21.15,16.2 21.15,17.25 | SW1.2 1.84,18.86 0.7,20 0.7,21.4 1.65,22.35 1.65,23.55 2.7,24.6 5.2,24.6 5.6,24.2 5.6,23.25 6.15,22.7 9.7,22.7 10.7,21.7 11.2,21.7 11.85,22.35 22,22.35 22.05,22.4 22.75,22.4 23,22.15 C8.1 | 23.1,20.98 L1.1 23.04,20.3 23.2,20.3 | C8.1 23.25,22.4 23.9,22.95 U4.B1 | 23.1,22.1 C8.1
  Top 0.305: 21.6,14.2 22.6,13.2 22.6,12 22.7,11.9 22.7,9.37 22.62,9.45 21.55,9.45 U1.3 21.35,9.25 20.9,9.65 19.85,9.65 19.45,9.3 U1.1 | 21.15,17.25 21.85,17.95 23.2,17.95 23.5,18.25 23.5,20 23.2,20.3 | 23.1,20.98 23.1,22.1

### Text on the board
Dimension: ^ V-SCORE EDGE ALONG OUTLINE ^
tPlace: OFF | ON | TinyScreen+ | ASM2022 Rev3 | Tiny-Circuits.com | - | + | <-CHARGE LED
Document: FABRICATION DRAWING | NOTES: | 1. PRINTED CIRCUIT BOARD MADE FROM NEMA GRADE FR-4 EPOXY LAMINATE | WITH 1 OUNCE COPPER PLATING AND .024 THICKNESS. | 2. ALL DIMENSIONS ARE GIVEN IN INCHES. | 3. CIRCUIT PATHS ARE FOR REFERENCE ONLY. | 4. HOLE SIZES SHOWN ARE FINISHED DIAMETERS AFTER PLATING. | 5. BOARD PLATED USING REFLOW OR SIMILAR METHOD. | 6. BOARD TO HAVE BLUE SOLDER MASK ON PLATED SURFACES USING WET FILM | 7. SILKSCREEN BOARD USING WHITE INK. | SR100 OR SR1010 EPOXY. EQUIVALENT WET OR DRY FILM MAY BE USED. | 8. THE FOLLOWING INFORMATION APPLIES TO THIS BOARD: | * 2 COPPER LAYERS | * .024 BOARD THICKNESS | * REQUIRES TOP SIDE SILKSCREEN | Released under the Creative Commons Attribution Share-Alike 3.0 License | http://creativecommons.org/licenses/by-sa/3.0 | LilyPad Arduino Design by Leah Buechley and Sparkfun Electronics | Original Arduino Uno Design by Team Arduino | TinyDuino, TinyLily and TinyShield Designs by TinyCircuits | TinyScreen+ | AS-PCB-ASM2022 | 3